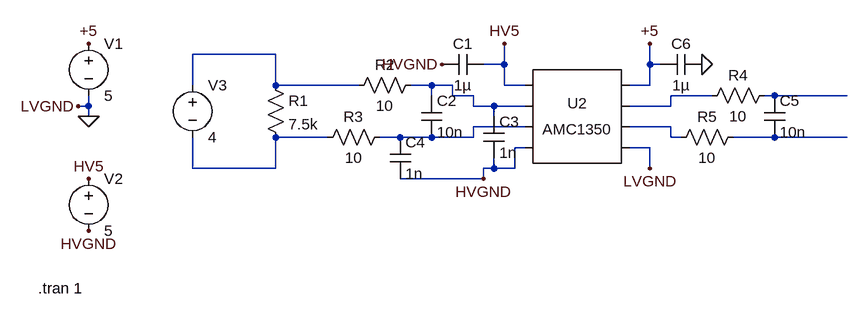
[diagram p0: schematic SensingSim.asc]
SensingSim.asc, the LTspice schematic file:
Version 4
SHEET 1 880 680
WIRE -256 80 -384 80
WIRE 96 96 96 64
WIRE 96 96 64 96
WIRE 320 96 320 64
WIRE 336 96 320 96
WIRE -384 128 -384 80
WIRE -256 128 -256 80
WIRE -128 128 -256 128
WIRE -16 128 -48 128
WIRE 16 128 -16 128
WIRE 96 128 96 96
WIRE 128 128 96 128
WIRE 320 128 320 96
WIRE 320 128 288 128
WIRE -16 144 -16 128
WIRE 16 144 16 128
WIRE 48 144 16 144
WIRE 416 144 352 144
WIRE 512 144 496 144
WIRE 624 144 512 144
WIRE -544 160 -544 144
WIRE -544 160 -560 160
WIRE 48 160 48 144
WIRE 80 160 48 160
WIRE 128 160 80 160
WIRE 352 160 352 144
WIRE 352 160 288 160
WIRE -544 176 -544 160
WIRE 80 176 80 160
WIRE 128 192 48 192
WIRE 352 192 288 192
WIRE -176 208 -256 208
WIRE -64 208 -96 208
WIRE -16 208 -64 208
WIRE 48 208 48 192
WIRE 48 208 -16 208
WIRE 352 208 352 192
WIRE 368 208 352 208
WIRE 512 208 448 208
WIRE 624 208 512 208
WIRE 128 224 112 224
WIRE 320 224 288 224
WIRE -384 256 -384 208
WIRE -256 256 -256 208
WIRE -256 256 -384 256
WIRE 80 256 80 240
WIRE 80 256 64 256
WIRE 112 256 112 224
WIRE 112 256 80 256
WIRE 320 256 320 224
WIRE 64 272 64 256
WIRE 64 272 -64 272
FLAG 320 64 +5
FLAG 96 64 HV5
FLAG 320 256 LVGND
FLAG 64 272 HVGND
FLAG -544 176 0
FLAG -560 160 LVGND
FLAG -544 352 HVGND
FLAG -544 272 HV5
FLAG -544 64 +5
FLAG 400 96 0
FLAG 0 96 HVGND
SYMBOL cap 64 80 R90
WINDOW 0 0 32 VBottom 2
WINDOW 3 32 32 VTop 2
SYMATTR InstName C1
SYMATTR Value 1µ
SYMBOL res -272 112 R0
SYMATTR InstName R1
SYMATTR Value 7.5k
SYMBOL res -32 112 R90
WINDOW 0 0 56 VBottom 2
WINDOW 3 32 56 VTop 2
SYMATTR InstName R2
SYMATTR Value 10
SYMBOL res -80 192 R90
WINDOW 0 0 56 VBottom 2
WINDOW 3 32 56 VTop 2
SYMATTR InstName R3
SYMATTR Value 10
SYMBOL cap -32 144 R0
SYMATTR InstName C2
SYMATTR Value 10n
SYMBOL cap 64 176 R0
SYMATTR InstName C3
SYMATTR Value 1n
SYMBOL cap -80 208 R0
SYMATTR InstName C4
SYMATTR Value 1n
SYMBOL cap 496 144 R0
SYMATTR InstName C5
SYMATTR Value 10n
SYMBOL res 464 192 R90
WINDOW 0 0 56 VBottom 2
WINDOW 3 32 56 VTop 2
SYMATTR InstName R5
SYMATTR Value 10
SYMBOL res 512 128 R90
WINDOW 0 0 56 VBottom 2
WINDOW 3 32 56 VTop 2
SYMATTR InstName R4
SYMATTR Value 10
SYMBOL cap 400 80 R90
WINDOW 0 0 32 VBottom 2
WINDOW 3 32 32 VTop 2
SYMATTR InstName C6
SYMATTR Value 1µ
SYMBOL voltage -544 48 R0
WINDOW 123 24 114 Left 2
WINDOW 39 0 0 Left 0
SYMATTR InstName V1
SYMATTR Value 5
SYMBOL voltage -544 256 R0
WINDOW 123 24 114 Left 2
WINDOW 39 0 0 Left 0
SYMATTR InstName V2
SYMATTR Value 5
SYMBOL voltage -384 112 R0
WINDOW 123 0 0 Left 0
WINDOW 39 0 0 Left 0
SYMATTR InstName V3
SYMATTR Value 4
SYMBOL AutoGenerated\\AMC1350 208 176 R0
SYMATTR InstName U2
TEXT -622 440 Left 2 !.tran 1

The netlist it stands for:
* SensingSim.asc
C1 HV5 HVGND 1µ
R1 N001 N007 7.5k
R2 N002 N001 10
R3 N005 N007 10
C2 N002 N005 10n
C3 N002 HVGND 1n
C4 N005 HVGND 1n
C5 N004 N008 10n
R5 N008 N006 10
R4 N004 N003 10
C6 0 +5 1µ
V1 +5 0 5
V2 HV5 HVGND 5
V3 N001 N007 4
* U2: AMC1350 (symbol AutoGenerated\AMC1350 not available, pins judged from their places): pin1=HV5 pin2=N002 pin3=N005 pin4=HVGND pin5=+5 pin6=N003 pin7=N006 pin8=0
.tran 1
.backanno
.end